# EAGLE design Sensor_ESP32_1.1 (EAGLE 9.6.2)
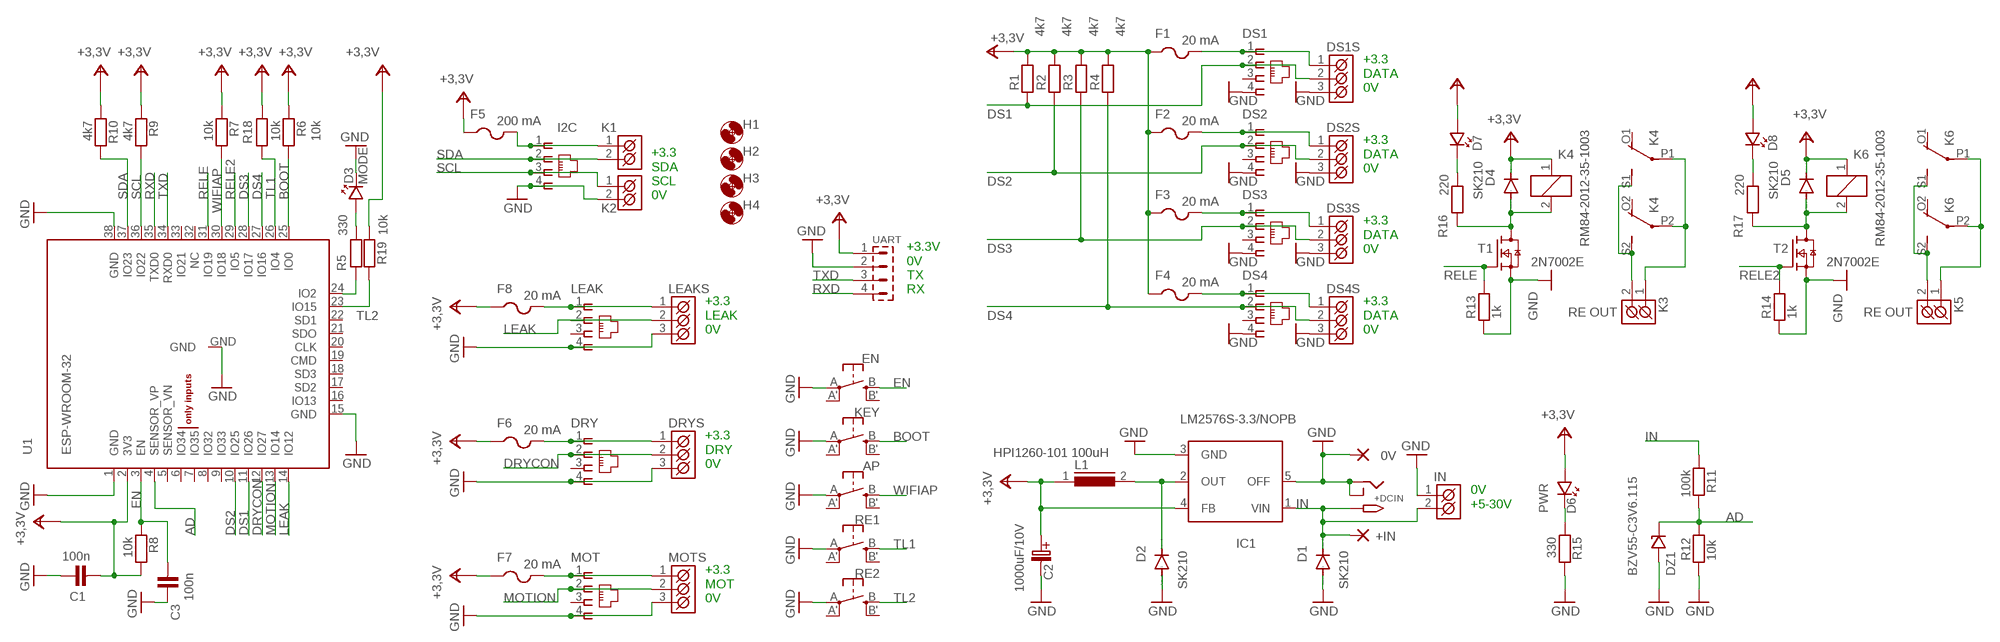
[diagram p0: schematic, sheet 1]

## Parts
0V  SMD2  [SMD1,27-2,54]
+DCIN  2.1MMJACKTHM  [PJ-102A]
+IN  SMD2  [SMD1,27-2,54]
AP  SPST_TACT-EVQQ2  [EVQ-Q2]
C1  100n  C-KER_1206  [1206]
C2  1000uF/10V  C-EL_5  [C-EL_5]
C3  100n  C-KER_1206  [1206]
D1  SK210  DIODE-SMB  [SMB]
D2  SK210  DIODE-SMB  [SMB]
D3  MODE  LED_1206  [P1206]
D4  SK210  DIODE-SMB  [SMB]
D5  SK210  DIODE-SMB  [SMB]
D6  PWR  LED_1206  [P1206]
D7  LED_1206  [P1206]
D8  LED_1206  [P1206]
DRY  WEBP_6_1  [WEBP_6_1]
DRYS  ARK550/3  [ARK550/3]
DS1  WEBP_6_1  [WEBP_6_1]
DS1S  ARK550/3  [ARK550/3]
DS2  WEBP_6_1  [WEBP_6_1]
DS2S  ARK550/3  [ARK550/3]
DS3  WEBP_6_1  [WEBP_6_1]
DS3S  ARK550/3  [ARK550/3]
DS4  WEBP_6_1  [WEBP_6_1]
DS4S  ARK550/3  [ARK550/3]
DZ1  BZV55-C3V6.115  D-BZV55C_SMD_0,5W-ZENER  [SOD-80]
EN  SPST_TACT-EVQQ2  [EVQ-Q2]
F1  20 mA  PTCFUSE-1206  [R1206]
F2  20 mA  PTCFUSE-1206  [R1206]
F3  20 mA  PTCFUSE-1206  [R1206]
F4  20 mA  PTCFUSE-1206  [R1206]
F5  200 mA  PTCFUSE-1206  [R1206]
F6  20 mA  PTCFUSE-1206  [R1206]
F7  20 mA  PTCFUSE-1206  [R1206]
F8  20 mA  PTCFUSE-1206  [R1206]
H1  MOUNT-HOLE3.0  [3,0]
H2  MOUNT-HOLE3.0  [3,0]
H3  MOUNT-HOLE3.0  [3,0]
H4  MOUNT-HOLE3.0  [3,0]
I2C  WEBP_6_1  [WEBP_6_1]
IC1  LM2576S-3.3/NOPB  LM2576S  [TO263-5]
IN  ARK550/2  [ARK550/2]
K1  ARK550/2  [ARK550/2]
K2  ARK550/2  [ARK550/2]
K3  RE OUT  ARK500/2  [ARK500/2]
K4  RM84-2012-35-1003  G2R2  [G2R2]
K5  RE OUT  ARK500/2  [ARK500/2]
K6  RM84-2012-35-1003  G2R2  [G2R2]
KEY  SPST_TACT-EVQQ2  [EVQ-Q2]
L1  HPI1260-101 100uH  DR125  [DR125]
LEAK  WEBP_6_1  [WEBP_6_1]
LEAKS  ARK550/3  [ARK550/3]
MOT  WEBP_6_1  [WEBP_6_1]
MOTS  ARK550/3  [ARK550/3]
R1  4k7  R_1206  [1206]
R2  4k7  R_1206  [1206]
R3  4k7  R_1206  [1206]
R4  4k7  R_1206  [1206]
R5  330  R_1206  [1206]
R6  10k  R_1206  [1206]
R7  10k  R_1206  [1206]
R8  10k  R_1206  [1206]
R9  4k7  R_1206  [1206]
R10  4k7  R_1206  [1206]
R11  100k  R_1206  [1206]
R12  10k  R_1206  [1206]
R13  1k  R_1206  [1206]
R14  1k  R_1206  [1206]
R15  330  R_1206  [1206]
R16  220  R_1206  [1206]
R17  220  R_1206  [1206]
R18  10k  R_1206  [1206]
R19  10k  R_1206  [1206]
RE1  SPST_TACT-EVQQ2  [EVQ-Q2]
RE2  SPST_TACT-EVQQ2  [EVQ-Q2]
T1  2N7002E  [SOT23]
T2  2N7002E  [SOT23]
U1  ESP-WROOM-32  [ESP-WROOM-32]
UART  S1G4_JUMP  [S1G4_JUM]

## Nets
+3,3V: C1.2 C2.C+(C_EL+) D4.C D5.C D6.A D7.A D8.A F1.1 F2.1 F3.1 F4.1 F5.1 F6.1 F7.1 F8.1 IC1.4(FB) K4.1 K6.1 L1.1 R1.2 R2.2 R3.2 R4.2 R6.1 R7.1 R8.2 R9.1 R10.1 R18.1 R19.1 U1.2(3V3) UART.1
AD: DZ1.K R11.2 R12.2 U1.4(SENSOR_VP)
BOOT: KEY.B(S) R6.2 U1.25(IO0)
DRYCON: DRY.2 DRYS.2(K2) U1.12(IO27)
DS1: DS1.2 DS1S.2(K2) R1.1 U1.11(IO26)
DS2: DS2.2 DS2S.2(K2) R2.1 U1.10(IO25)
DS3: DS3.2 DS3S.2(K2) R3.1 U1.28(IO17)
DS4: DS4.2 DS4S.2(K2) R4.1 U1.27(IO16)
EN: C3.2 EN.B(S) R8.1 U1.3(EN)
GND: 0V.1(P) +DCIN.RING +DCIN.RING_SW AP.A(P) C1.1 C2.C-(C_EL-) C3.1 D1.A D2.A D3.K DRY.4 DRYS.3(K3) DS1.4 DS1S.3(K3) DS2.4 DS2S.3(K3) DS3.4 DS3S.3(K3) DS4.4 DS4S.3(K3) DZ1.A EN.A(P) I2C.4 IC1.3(GND) IC1.5(OFF) IN.1(K1) K2.2(K2) KEY.A(P) LEAK.4 LEAKS.3(K3) MOT.4 MOTS.3(K3) R12.1 R13.1 R14.1 R15.2 RE1.A(P) RE2.A(P) T1.2(S) T2.2(S) U1.1(GND) U1.15(GND) U1.38(GND) U1.GND UART.2
IN: +DCIN.TIP +IN.1(P) D1.C IC1.1(VIN) IN.2(K2) R11.1
LEAK: LEAK.2 LEAKS.2(K2) U1.14(IO12)
MOTION: MOT.2 MOTS.2(K2) U1.13(IO14)
N$1: DS1.1 DS1S.1(K1) F1.2
N$2: D2.C IC1.2(OUT) L1.2
N$3: DS2.1 DS2S.1(K1) F2.2
N$4: F8.2 LEAK.1 LEAKS.1(K1)
N$5: DS3.1 DS3S.1(K1) F3.2
N$6: DS4.1 DS4S.1(K1) F4.2
N$7: F5.2 I2C.1 K1.1(K1)
N$8: D4.A K4.2 R16.2 T1.3(D)
N$9: R5.2 U1.24(IO2)
N$10: K3.2(K2) K4.S1(2:S) K4.S2(3:S)
N$11: K3.1(K1) K4.P1(2:P) K4.P2(3:P)
N$12: DRY.1 DRYS.1(K1) F6.2
N$13: F7.2 MOT.1 MOTS.1(K1)
N$14: D5.A K6.2 R17.2 T2.3(D)
N$15: K5.2(K2) K6.S1(2:S) K6.S2(3:S)
N$16: K5.1(K1) K6.P1(2:P) K6.P2(3:P)
N$17: D6.K R15.1
N$18: D3.A R5.1
N$19: D7.K R16.1
N$20: D8.K R17.1
RELE: R13.2 T1.1(G) U1.31(IO19)
RELE2: R14.2 T2.1(G) U1.29(IO5)
RXD: U1.35(TXD0) UART.4
SCL: I2C.3 K2.1(K1) R9.2 U1.36(IO22)
SDA: I2C.2 K1.2(K2) R10.2 U1.37(IO23)
TL1: R18.2 RE1.B(S) U1.26(IO4)
TL2: R19.2 RE2.B(S) U1.23(IO15)
TXD: U1.34(RXD0) UART.3
WIFIAP: AP.B(S) R7.2 U1.30(IO18)
Unconnected: AP.A'(P1) AP.B'(S1) DRY.3 DS1.3 DS2.3 DS3.3 DS4.3 EN.A'(P1) EN.B'(S1) K4.O1(2:O) K4.O2(3:O) K6.O1(2:O) K6.O2(3:O) KEY.A'(P1) KEY.B'(S1) LEAK.3 MOT.3 RE1.A'(P1) RE1.B'(S1) RE2.A'(P1) RE2.B'(S1) U1.5(SENSOR_VN) U1.6(IO34) U1.7(IO35) U1.8(IO32) U1.9(IO33) U1.16(IO13) U1.17(SD2) U1.18(SD3) U1.19(CMD) U1.20(CLK) U1.21(SDO) U1.22(SD1) U1.32(NC) U1.33(IO21)

## Notes on the sheet
- +3.3
  DATA
  0V
- +3.3
  DATA
  0V
- +3.3
  SDA
  SCL
  0V
- +3.3
  DATA
  0V
- +3.3V
  0V
  TX
  RX
- +3.3
  LEAK
  0V
- +3.3
  DATA
  0V
- +3.3
  DRY
  0V
- 0V
  +5-30V
- +3.3
  MOT
  0V

## Library data of the parts
0V +IN = wirepad:SMD2: SMD PAD
+DCIN = adafruit:2.1MMJACK: 2.1mm x 5.5mm THM DC jack with internal switch. Digikey part #PJ-102A, 4UCON part #05537 2.1mm x 5.5mm SMT DC jack with internal switch. Digikey part #PJ-002A-SMT, 4UCON part #03267 By microbuilder.eu & adafruit.com
AP EN KEY RE1 RE2 = adafruit:SPST_TACT: SMT 6mm switch, EVQQ2 series http://www.ladyada.net/library/eagle
C1 C3 = #PaJa_31:C-KER: Kondenzator - keramicky
C2 = #PaJa_31:C-EL: Kondenzator - elektrolyticky
D1 D2 D4 D5 = diode:DIODE-: DIODE
D3 D6-D8 = #PaJa_31:LED: LED - jednobarevna
DRY DS1-DS4 I2C LEAK MOT = #PaJa_konektory:WEBP_6_1
DRYS DS1S DS2S DS3S DS4S LEAKS MOTS = #PaJa_konektory:ARK550/3: Svorkovnice - roztec 3,5mm - trojita
DZ1 = #PaJa_31:D-?-ZENER: Zenerova dioda
F1-F8 = adafruit:PTCFUSE: PTC fuses, resettable thermistors
H1-H4 = holes:MOUNT-HOLE: MOUNTING HOLE with drill center marker
IC1 = v-reg-3:LM2576: National Semiconductor <http://www.national.com> 3.0A "Simple Switcher"(c) 52kHz, Vout 1.23-37V (HV: 57V), Vin 40V (HV: 60V), 50µA standby current
IN K1 K2 = #PaJa_konektory:ARK550/2: Svorkovnice - roztec 3,5mm - dvojita
K3 K5 = #PaJa_konektory:ARK500/2: Svorkovnice - roztec 5mm - dvojita
K4 K6 = relay:G2R2: RELAY 2 x switch, Omron; MF: OMRON COMPONENTS USA; MPN: G2R-2-DC6; OC_FARNELL: unknown; OC_NEWARK: 89C5317
L1 = inductors:DR125: High Power Density, High Efficiency, Shielded Inductors Source: coiltronics_dr_series.pdf; SPICEPREFIX: L
R1-R19 = #PaJa_31:R: Rezistor
T1 T2 = nxp_60:2N7002: N-channel TrenchMOS FET N-channel enhancement mode Field-Effect Transistor (FET) in a plastic package using TrenchMOS technology. AAL Eindhoven MK
U1 = esp32:ESP-WROOM-32
UART = #PaJa_konektory:S1G4_JUMP: Radove konektory - koliky - 4x

## Board
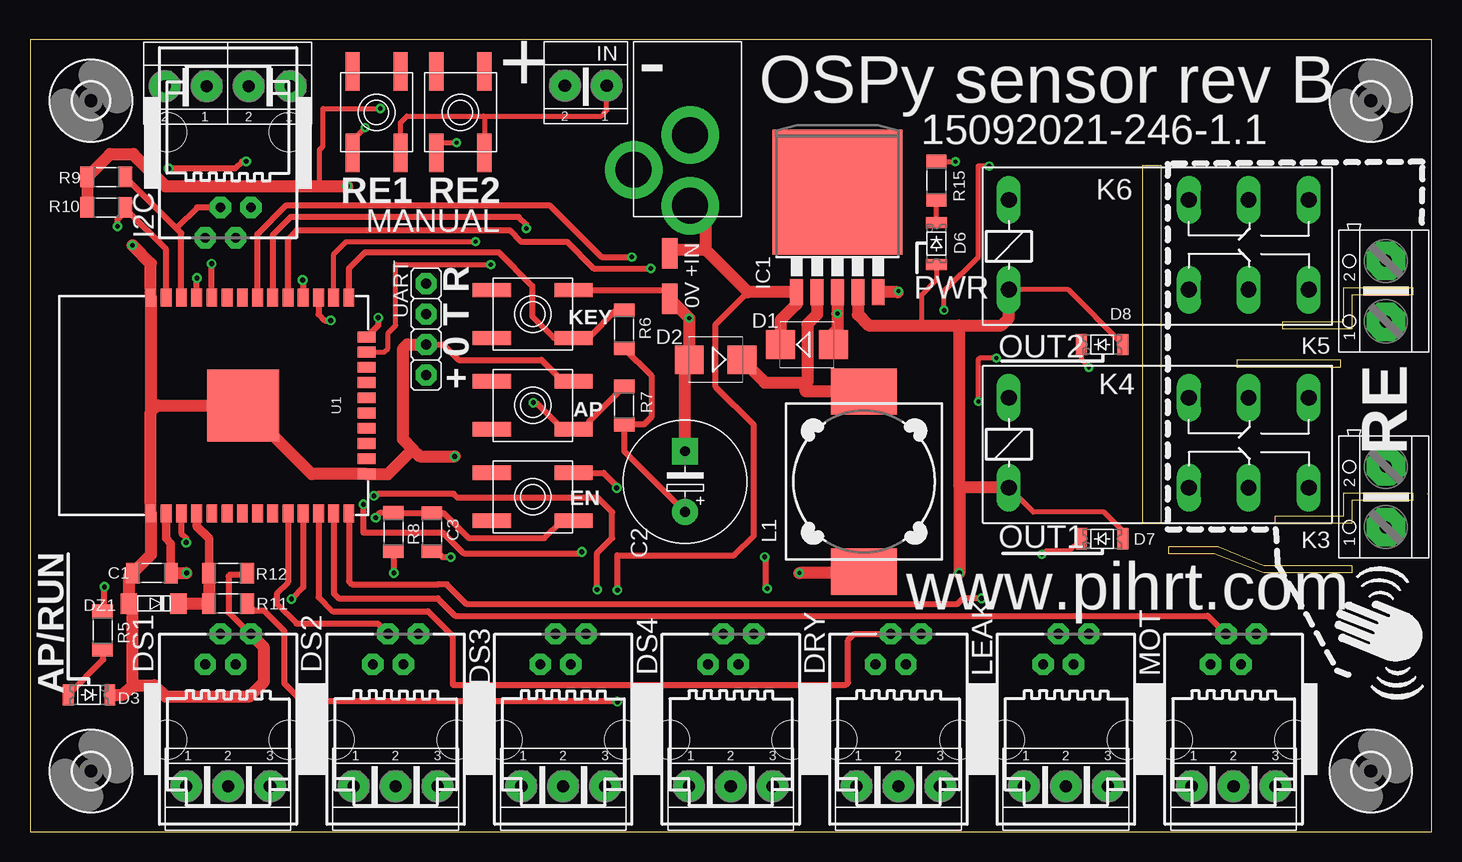
[diagram p1: board, top side]
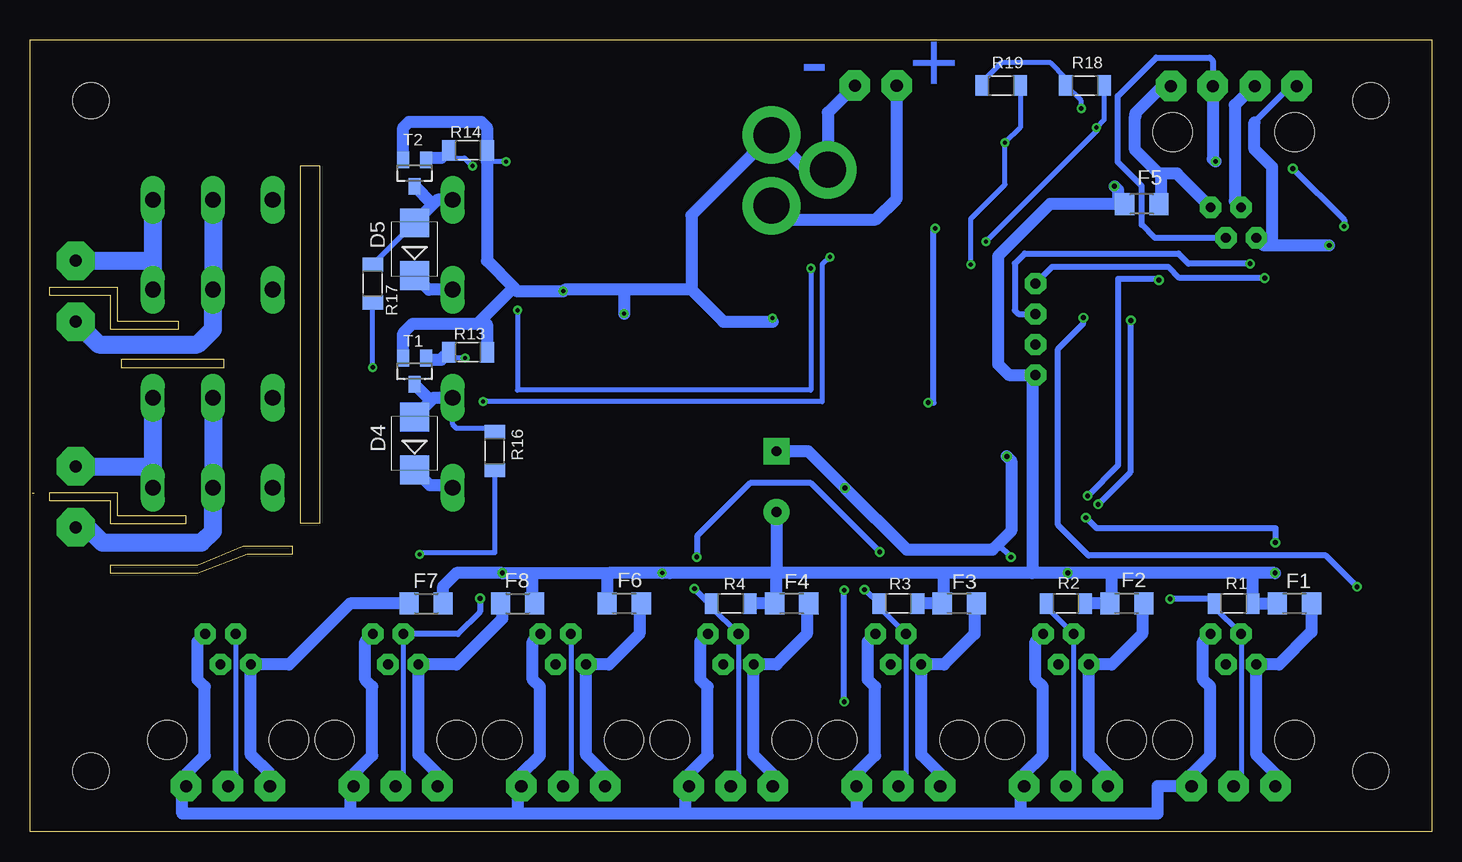
[diagram p2: board, bottom side, seen from below]

Size 116.84 x 66.04 mm. Coordinates in mm from the lower left corner, seen from the top.
Outline: 116.48,28.23 116.66,28.24
Outline: 0,0 116.84,0 116.84,66.04 0,66.04 0,0
Outline: 92.71,55.56 92.71,25.72 94.3,25.72 94.3,55.56 92.71,55.56
Outline: 104.46,42.55 109.54,42.55 109.54,45.4 115.25,45.4 115.25,44.77 110.17,44.77 110.17,41.91 104.46,41.91 104.46,42.55
Outline: 100.65,39.37 109.22,39.37 109.22,38.73 100.65,38.73 100.65,39.37
Outline: 103.82,26.35 109.54,26.35 109.54,28.26 115.25,28.26 115.25,27.62 110.17,27.62 110.17,25.72 103.82,25.72 103.82,26.35
Outline: 99.06,23.81 102.87,22.23 110.17,22.23 110.17,21.59 102.87,21.59 98.74,23.18 94.93,23.18 94.93,23.81 99.06,23.81
Copper layers (1*16): Top 0.035mm / dielectric 1.5mm / Bottom 0.035mm
Design rules "default": minimum track width 6mil, minimum drill 0.35mm, track to track 6mil, track to pad 6mil, pad to pad 6mil, via to via 6mil, smd to smd 6mil, copper to edge 40mil, drill to drill 6mil, minimum pad ring 10mil, minimum via ring 8mil, stop-mask expansion 4mil, vias tented up to drill 0mil, thermal gap 10mil

### Footprints (pad centres in the part's own frame; a part is rotated, then mirrored left to right if it is on the bottom)
SMD1,27-2,54 = smd 1.27 x 2.54: 1 0,0
PJ-102A = drill 3 pad 4.8: RING 0.1,-3.39; RING_SW -4.6,-6.29; TIP 0.1,-9.29
EVQ-Q2 = smd 3.2 x 1.2: A -3.4,-2; A' 3.4,-2; B -3.4,2; B' 3.4,2
1206 = smd 1.143 x 1.702: 1 -1.587,0; 2 1.587,0
C-EL_5 = drill 0.813 pad 2.184: C+ -2.54,0 | drill 0.813 pad 2.184 square: C- 2.54,0
SMB = smd 2.4 x 2.4: A 2.2,0; C -2.2,0
P1206 = smd 0.914 x 1.778: A -1.905,0; K 1.587,0
WEBP_6_1 = drill 0.813 pad 1.778 octagon: 1 -1.905,6.35; 2 -0.635,8.89; 3 0.635,6.35; 4 1.905,8.89 | hole 3.251: -5.08,0.064; 5.08,0.064
ARK550/3 = drill 1.016 pad 2.54 octagon: 1 -3.493,0; 2 0,0; 3 3.493,0
SOD-80 = smd 1.397 x 1.702: A 1.905,0; K -2.223,0
R1206 = smd 1.6 x 1.803: 1 -1.422,0; 2 1.422,0
3,0 = hole 3: 0,0
TO263-5 = smd 1.067 x 2.159: 1 -3.404,-5.791; 2 -1.702,-5.791; 3 0,-5.791; 4 1.702,-5.791; 5 3.404,-5.791 | smd 10.8 x 10.41: 6 0,2.54
ARK550/2 = drill 1.016 pad 2.54 octagon: 1 0,0; 2 3.493,0
ARK500/2 = drill 1 pad 3.2 octagon: 1 -2.54,0; 2 2.54,0
G2R2 = drill 1.321 long: 1 -2.54,-3.683; 2 -2.54,3.81; O1 12.471,3.81; O2 12.471,-3.683; P1 17.45,3.81; P2 17.45,-3.683; S1 22.454,3.81; S2 22.454,-3.683
DR125 = smd 3.85 x 5.5: 1 -7.515,0; 2 7.515,0
SOT23 = smd 1 x 1.4: 1 -0.95,-1.1; 2 0.95,-1.1; 3 0,1.1
ESP-WROOM-32 = smd 0.9 x 1.5: 1 7.7,9; 2 6.43,9; 3 5.16,9; 4 3.89,9; 5 2.62,9; 6 1.35,9; 7 0.08,9; 8 -1.19,9; 9 -2.46,9; 10 -3.73,9; 11 -5,9; 12 -6.27,9; 13 -7.54,9; 14 -8.81,9; 25 -8.81,-9; 26 -7.54,-9; 27 -6.27,-9; 28 -5,-9; 29 -3.73,-9; 30 -2.46,-9; 31 -1.19,-9; 32 0.08,-9; 33 1.35,-9; 34 2.62,-9; 35 3.89,-9; 36 5.16,-9; 37 6.43,-9; 38 7.7,-9 | smd 1.5 x 0.9: 15 -10.3,5.715; 16 -10.3,4.445; 17 -10.3,3.175; 18 -10.3,1.905; 19 -10.3,0.635; 20 -10.3,-0.635; 21 -10.3,-1.905; 22 -10.3,-3.175; 23 -10.3,-4.445; 24 -10.3,-5.715 | smd 6 x 6: GND 0,0
S1G4_JUM = drill 0.813 pad 1.778 octagon: 1 -3.81,0; 2 -1.27,0; 3 1.27,0; 4 3.81,0

### Placement (x,y rotation side)
0V  53.34,44.45 0 top
+DCIN  54.93,61.5 0 top
+IN  53.34,48.26 0 top
AP  41.91,35.56 180 top
C1  10.16,21.59 0 top
C2  54.61,29.21 90 top
C3  33.51,25 90 top
D1  64.77,40.64 0 top
D2  57.15,39.37 180 top
D3  5.08,11.43 0 top
D4  84.77,32.38 90 bottom
D5  84.77,48.58 90 bottom
D6  75.56,49.21 90 top
D7  89.22,24.45 180 top
D8  89.22,40.64 180 top
DRY  72.39,7.62 0 top
DRYS  72.39,3.81 0 top
DS1  16.51,7.62 0 top
DS1S  16.51,3.81 0 top
DS2  30.48,7.62 0 top
DS2S  30.48,3.81 0 top
DS3  44.45,7.62 0 top
DS3S  44.45,3.81 0 top
DS4  58.42,7.62 0 top
DS4S  58.42,3.81 0 top
DZ1  10.16,19.05 180 top
EN  41.91,27.94 180 top
F1  11.43,19.05 0 bottom
F2  25.4,19.05 0 bottom
F3  39.37,19.05 0 bottom
F4  53.34,19.05 0 bottom
F5  24.16,52.35 0 bottom
F6  67.31,19.05 0 bottom
F7  83.82,19.05 180 bottom
F8  76.2,19.05 180 bottom
H1  5.08,5.08 0 top
H2  5.08,60.96 0 top
H3  111.76,60.96 0 top
H4  111.76,5.08 0 top
I2C  16.51,58.42 180 top
IC1  67.31,50.8 0 top
IN  48.08,62.23 180 top
K1  21.73,62.19 180 top
K2  14.73,62.19 180 top
K3  113.03,27.94 90 top
K4  84.14,32.38 0 top
K5  113.03,45.09 90 top
K6  84.14,48.9 0 top
KEY  41.91,43.18 180 top
L1  69.53,29.21 90 top
LEAK  86.36,7.62 0 top
LEAKS  86.36,3.81 0 top
MOT  100.33,7.62 0 top
MOTS  100.33,3.81 0 top
R1  16.51,19.05 0 bottom
R2  30.48,19.05 0 bottom
R3  44.45,19.05 0 bottom
R4  58.42,19.05 0 bottom
R5  6.06,16.8 90 top
R6  49.53,41.91 90 top
R7  49.53,35.56 90 top
R8  30.3,25 270 top
R9  6.35,54.61 0 top
R10  6.35,52.07 0 top
R11  16.51,19.05 180 top
R12  16.51,21.59 180 top
R13  80.33,40.01 180 bottom
R14  80.33,56.83 180 bottom
R15  75.56,54.29 90 top
R16  78.11,31.75 90 bottom
R17  88.27,45.72 90 bottom
R18  28.89,62.23 0 bottom
R19  35.88,62.23 0 bottom
RE1  28.89,60.01 90 top
RE2  35.88,60.01 90 top
T1  84.77,38.42 180 bottom
T2  84.77,54.93 180 bottom
U1  17.78,35.56 180 top
U$1  [GESTURESENSE_NOTEXT]  116.2,10.79 90 top
UART  33.02,41.91 90 top

### Tracks (layer width: path | path; a pad name or v marks a point on that pad's centre or on a via)
+3,3V  (via drill 0.35, 0.4)
  Top 0.406: 77.66,28.7 77.47,28.89 | D6.A 75.56,46.04 74.3,44.77 74.3,42.23 | D7.A 91.12,25.08 89.53,26.67 83.63,26.67 K4.1 | D8.A 86.55,45.21 K6.1 | 24.13,53.84 24.13,56.87 24.43,57.18 24.43,60.31 24.45,60.33 v29.21,60.33 | L1.1 69.53,21.59
  Top 0.5: 26.44,53.84 v26.44,53.84 | R8.2 30.3,21.78 30.33,21.76 v30.33,21.59 | C2.C+ 49.53,31.75 R7.1 51.2,33.97 51.81,34.58 51.81,38.05 R6.1
  Top 0.7: U1.2 11.35,24.46 11.75,24.07 C1.2
  Top 1: R10.1 R9.1 6.68,56.52 8.61,56.52 11.3,53.84 24.13,53.84 26.44,53.84 | C1.2 13.01,21.59 13.03,21.57 v13.05,21.59 | IC1.4 69.01,43.12 69.91,42.23 74.3,42.23 77.47,42.23 | v77.47,21.59 77.47,28.89 77.47,42.23 | K4.1 77.66,28.7 | K6.1 81.6,42.86 80.96,42.23 77.47,42.23 | 69.53,21.59 v64.14,21.59
  Bottom 0.406: 84.77,30.16 D4.C | R19.1 37.47,62.55 35.88,64.14 31.75,64.14 30.48,62.87 R18.1 29.21,60.96 v29.21,60.33
  Bottom 1: F1.1 R1.2 14.92,21.59 | R2.2 F2.1 26.67,19.2 26.67,21.59 | R3.2 F3.1 40.64,19.2 40.64,21.59 | R4.2 F4.1 54.61,19.2 54.61,21.59 | 14.92,21.59 26.67,21.59 | 26.67,21.59 v30.33,21.59 33.28,21.59 | 33.28,21.59 40.64,21.59 | 40.64,21.59 54.61,21.59 | 54.61,21.59 63.5,21.59 v64.14,21.59 68.58,21.59 | 68.58,21.59 68.73,21.44 F6.1 | F7.1 82.4,20.47 81.28,21.59 v77.47,21.59 74.93,21.59 | 74.93,21.59 68.58,21.59 | F8.1 74.93,19.2 74.93,21.59 | v26.44,53.84 26.13,53.54 26.13,52.9 F5.1 31.81,52.35 36.15,48.01 36.15,39.01 35.24,38.1 UART.1 33.28,37.84 33.28,21.59 | v13.05,21.59 14.92,21.59 | C2.C+ 54.61,21.59 | K4.1 81.79,28.89 83.5,28.89 84.77,30.16 | K6.1 83.61,45.21 D5.C
AD
  Top 0.7: U1.4 13.91,26.54 13.91,25.48 14.92,24.47 R12.2
  Top 1: DZ1.K R11.2 R12.2
BOOT
  Top 0.5: R6.2 48.87,43.5 46.55,41.18 KEY.B 43.67,41.18 41.87,42.98 41.87,45.53 39.06,48.34 27.93,48.34 26.59,47 U1.25
DRYCON
  Top 0.5: U1.12 24.05,19.58 25.23,18.41 33.17,18.41 35.24,16.34 35.24,12.27 68.02,12.27 68.2,12.45 68.2,16.01 68.7,16.51 DRY.2
  Bottom 0.4: DRY.2 71.75,4.45 DRYS.2
DS1  (via drill 0.4)
  Top 0.5: U1.11 22.78,20.41 v21.79,19.42
  Bottom 0.4: DS1S.2 15.88,4.45 DS1.2 18.1,18.73 R1.1
  Bottom 0.5: v21.79,19.42 21.75,19.46 18.51,19.46 R1.1
DS2
  Top 0.5: U1.10 21.51,20.81 20.57,19.88 20.57,19.01 22.21,17.37 28.99,17.37 DS2.2
  Bottom 0.4: DS2S.2 29.84,4.45 DS2.2 32.07,18.73 R2.1
DS3  (via drill 0.4)
  Top 0.5: v47.28,20.2 47.28,23.27 48.52,24.5 48.52,26.68 47.35,27.85 35.67,27.85 35.33,28.19 29.04,28.19 28.78,27.92 v28.67,28.02 | v28.67,28.02 | v22.73,46.02 22.78,45.97 U1.28
  Bottom 0.4: DS3S.2 43.81,4.45 DS3.2 46.04,18.73 R3.1
  Bottom 0.5: R3.1 47.19,20.2 v47.28,20.2 | v28.67,28.02 26.13,30.56 26.13,46.12 22.8,46.12 22.8,46.09 v22.73,46.02
DS4  (via drill 0.4)
  Top 0.5: U1.27 24.05,43.16 24.57,42.65 v25.06,42.65 | v27.79,27.32 27.79,24.97 34.41,24.97 36.14,23.24 46.01,23.24 v46.01,23.35 | v61.26,22.92 61.31,22.86 61.31,20.39 61.43,20.28 v61.46,20.28
  Bottom 0.4: DS4S.2 57.78,4.45 DS4.2 60.01,18.73 R4.1
  Bottom 0.5: v25.06,42.65 25.11,42.65 25.11,29.99 v27.79,27.32 | v46.01,23.35 51.75,29.09 56.8,29.09 61.23,24.67 61.23,22.95 v61.26,22.92 | v61.46,20.28 60.23,19.05 R4.1
EN  (via drill 0.4)
  Top 0.5: v28.82,26.2 28.82,26.28 29.13,26.59 R8.1 C3.2 34.48,26.59 36.57,24.49 42.89,24.49 44.34,25.94 EN.B | v13.02,24.13 13.02,24.51 12.62,24.91 U1.3
  Bottom 0.5: v28.82,26.2 27.94,25.33 13.02,25.33 v13.02,24.13
GND  (via drill 0.35, 0.4)
  Top 0.406: v72.39,45.09 72.31,45.01 | 54.61,39.03 D2.A | R15.2 v77.15,55.88 | RE1.A 30.89,59.15 31.43,59.69 37.78,59.69 | 37.78,59.69 37.88,59.59 RE2.A | 37.78,59.69 47.62,59.69 48.08,60.15 IN.1 | 29.63,29.84 29.84,29.84
  Top 0.5: R12.1 17.95,21.44 16.67,21.44 16.55,21.32 16.55,18.29 18.34,16.51 DS1.4 | KEY.A 53.24,45.18 53.33,45.27 53.34,45.25 0V.1 | UART.2 34.46,40.64 35.74,39.36 42.63,39.36 44.43,37.56 AP.A | EN.A 47.81,29.94 48.9,28.85 v48.9,28.69 | C3.1 33.95,23.41 34.41,22.95 34.38,22.91 v35.07,22.91
  Top 1: D3.K 7.74,11.43 8.54,12.23 | 8.54,12.23 8.54,18.76 DZ1.A 8.26,21.27 C1.1 10.08,23.1 U1.1 10.08,35.03 | 10.08,35.03 10.61,35.56 U1.GND 23.5,29.84 U1.15 29.63,29.84 | 10.08,35.03 U1.38 10.08,47.41 8.59,48.9 v8.54,48.9 | 8.54,12.23 10.36,12.23 11.29,11.3 18.3,11.3 19.52,12.51 19.52,15.37 18.38,16.51 18.34,16.51 | IC1.3 v67.31,43.22 67.32,43.21 67.32,41.95 66.97,41.59 D1.A | 0V.1 v54.95,42.84 D2.A | UART.2 31.46,40.64 31.07,40.26 31.07,32.74 31.91,31.91 | 72.31,45.01 IC1.5 | C2.C- 54.61,39.03 | v35.4,31.31 32.51,31.31 31.91,31.91 | 29.84,29.84 31.91,31.91
  Bottom 0.406: 85.72,41.59 | 78.82,42.39 78.74,42.31 | 85.72,58.73 85.72,58.74 | 54.93,42.55 54.93,42.82 v54.95,42.84 | v77.15,55.88 78.74,55.88
  Bottom 0.5: K2.2 11.77,62.19 14.78,59.18 | v35.07,22.91 | 36.15,23.99 v35.07,22.91
  Bottom 1: DS1.4 19.05,15.88 19.05,12.7 18.45,12.1 18.45,6.38 20,4.83 DS1S.3 22.86,3.81 22.86,1.52 34.29,1.52 | DS2.4 33.02,15.88 33.02,12.7 32.42,12.1 32.42,6.38 33.97,4.83 DS2S.3 34.29,3.49 34.29,1.52 | DS3.4 46.99,15.88 46.99,12.7 46.39,12.1 46.39,6.38 47.94,4.83 DS3S.3 47.94,1.83 48.26,1.52 | DS4.4 60.96,15.88 60.96,12.7 60.36,12.1 60.36,6.38 61.91,4.83 DS4S.3 62.23,3.49 62.23,1.52 | DRY.4 74.93,15.88 74.93,12.7 74.33,12.1 74.33,6.38 75.88,4.83 DRYS.3 76.2,3.49 76.2,1.52 | LEAK.4 88.9,15.88 88.9,12.7 88.3,12.1 88.3,6.38 89.85,4.83 LEAKS.3 90.17,3.49 90.17,1.52 | MOT.4 102.87,15.88 102.87,12.7 102.27,12.1 102.27,6.38 103.82,4.83 MOTS.3 104.14,3.49 104.14,1.52 90.17,1.52 | 34.29,1.52 48.26,1.52 | 48.26,1.52 62.23,1.52 | 62.23,1.52 76.2,1.52 | 76.2,1.52 90.17,1.52 | 14.78,59.18 14.78,56.91 13.32,55.45 13.32,49.02 13.2,48.9 | v8.54,48.9 13.2,48.9 | 13.2,48.9 13.98,48.9 I2C.4 | IN.1 50.33,59.98 +DCIN.RING_SW 52.13,55.21 +DCIN.RING 61.71,51.42 61.71,45.21 | C2.C- 51.97,31.75 v48.9,28.69 43.75,23.54 36.6,23.54 36.15,23.99 35.03,25.11 35.03,30.94 v35.4,31.31 | 61.71,45.21 67.31,45.21 | 67.31,45.21 72.26,45.21 v72.39,45.09 76.2,45.09 76.52,45.4 | T1.2 85.72,41.59 | 85.72,41.59 84.93,42.39 79.53,42.39 | 79.53,42.39 78.82,42.39 | 78.74,42.31 R13.1 | T2.2 85.72,58.73 | 85.72,58.74 85.25,59.21 79.22,59.21 78.74,58.74 R14.1 78.74,55.88 78.74,47.62 76.52,45.4 | 79.53,42.39 76.52,45.4 | 67.31,45.21 v67.31,43.22 | 61.71,45.21 59.04,42.55 54.93,42.55
IN  (via drill 0.4)
  Top 0.5: R11.1 18.67,18.48 18.67,18.47 19.47,18.47 21.19,16.75 21.19,12.38 22.66,10.91 48.89,10.91 48.9,10.93 v48.97,10.86 | v48.97,20.16 48.97,23.06 58.7,23.06 60.34,24.69 60.34,33.92 57.16,37.1 57.16,42.32 59.84,45.01
  Top 1: D1.C 62.57,42.67 63.91,44 IC1.1 59.84,45.01 56.3,48.55 | 56.3,48.55 56.3,50.94 +DCIN.TIP | +IN.1 53.63,48.55 56.3,48.55
  Bottom 0.5: v48.97,10.86 v48.97,20.16 | v48.97,20.16 | v48.97,20.16
  Bottom 1: +DCIN.TIP 53.88,51.06 46.34,51.06 44.59,52.81 IN.2
LEAK  (via drill 0.4)
  Top 0.5: U1.14 26.59,20.89 26.83,20.66 34.05,20.66 34.05,20.65 34.73,20.65 36.4,18.98 77.26,18.98 77.75,19.47 v79.32,19.47
  Bottom 0.4: LEAK.2 85.72,4.45 LEAKS.2
  Bottom 0.5: v79.32,19.47 79.34,19.46 79.34,18.35 81.18,16.5 LEAK.2
MOTION
  Top 0.5: U1.13 25.32,19.88 25.71,19.49 33.99,19.49 35.45,18.02 98.18,18.02 MOT.2
  Bottom 0.4: MOT.2 99.69,4.45 MOTS.2
N$1
  Bottom 1: DS1S.1 13.02,4.83 14.61,6.42 DS1.1 12.7,13.97 10.01,16.66 F1.2
N$2
  Top 1: IC1.2 65.61,43.15 64.8,42.35 64.8,37.47 64.66,37.47 | D2.C 61.26,37.47 64.66,37.47 | L1.2 64.66,36.73 64.66,37.47
N$3
  Bottom 1: DS2S.1 26.99,4.83 28.57,6.42 DS2.1 26.67,13.97 24.13,16.51 24.13,18.9 F2.2
N$4
  Bottom 1: LEAKS.1 82.87,4.83 84.45,6.42 LEAK.1 81.28,13.97 77.47,17.78 77.47,18.9 F8.2
N$5
  Bottom 1: DS3S.1 40.96,4.83 42.55,6.42 DS3.1 40.64,13.97 38.1,16.51 38.1,18.9 F3.2
N$6
  Bottom 1: DS4S.1 54.93,4.83 56.52,6.42 DS4.1 54.61,13.97 52.07,16.51 52.07,18.9 F4.2
N$7
  Bottom 1: I2C.1 21.23,54.89 22.54,54.89 | 22.54,54.89 22.74,54.89 24.73,56.88 24.73,59.66 24.69,59.7 24.69,59.94 22.44,62.19 K1.1 | F5.2 22.54,52.55 22.54,54.89
N$8
  Bottom 0.406: D4.A 84.77,34.92 84.45,34.92 | 83.65,36.2 83.19,36.2 | R16.2 78.42,33.66 81.28,33.66 81.6,33.97 K4.2
  Bottom 1: K4.2 83.19,36.2 84.45,34.92 | T1.3 83.65,36.2
N$9  (via drill 0.4)
  Top 0.5: R5.2 6.06,18.54 6.03,18.57 6.15,18.69 6.15,20.38 v6.21,20.44 | v29.03,42.88 29.03,42.22 U1.24
  Bottom 0.5: v6.21,20.44 8.81,23.04 28.6,23.04 31.15,25.58 31.15,40.28 29.03,42.4 v29.03,42.88
N$10
  Bottom 1.5: K4.S1 106.59,30.48 | 106.59,30.48 K4.S2 | K3.2 106.59,30.48
N$11
  Bottom 0.406: K3.1 112.08,25.4
  Bottom 1.5: K4.P1 K4.P2 101.59,25.09 102.55,24.13 110.81,24.13 112.08,25.4
N$12
  Bottom 1: DRYS.1 68.9,4.83 70.48,6.42 DRY.1 68.58,13.97 66.04,16.51 66.04,18.9 F6.2
N$13
  Bottom 1: MOTS.1 96.84,4.83 98.42,6.42 MOT.1 95.25,13.97 90.17,19.05 F7.2
N$14
  Bottom 0.406: D5.A 84.77,50.8 R17.2 | 83.34,52.4 83.34,52.23
  Bottom 1: K6.2 82.87,52.7 83.34,52.23 84.77,50.8 | T2.3 83.34,52.4
N$15
  Bottom 0.406: 106.91,47.62 106.59,47.94
  Bottom 1.5: K6.S1 106.59,47.94 K6.S2 | K5.2 106.91,47.62
N$16
  Bottom 1.5: K6.P1 K6.P2 101.59,41.92 102.87,40.64 111.12,40.64 K5.1
N$17
  Top 0.406: D6.K R15.1
N$18
  Top 0.5: D3.A 6.12,14.37 R5.1
N$19  (via drill 0.35)
  Top 0.406: v84.36,23.13 84.65,23.42 86.6,23.42 D7.K
  Bottom 0.406: R16.1 78.11,23.3 84.19,23.3 v84.36,23.13
N$20  (via drill 0.35)
  Top 0.406: v88.27,38.73 87.63,39.37 D8.K
  Bottom 0.406: v88.27,38.73 R17.1
RELE  (via drill 0.35)
  Top 0.406: v79.06,35.88 79.06,39.37 79.2,39.51 v80.56,39.51
  Top 0.5: U1.31 18.97,49.85 21.37,52.25 43.32,52.25 47.62,47.94 v50.16,47.94
  Bottom 0.406: T1.1 83.82,39.69 83.5,39.37 | R13.2 82.18,39.74 82.18,39.51 v80.56,39.51 | v50.16,47.94 50.8,47.31 50.8,35.88 v79.06,35.88
  Bottom 1: 83.5,39.37 82.55,39.37 R13.2
RELE2  (via drill 0.35)
  Top 0.406: v76.2,43.5 76.2,45.09 79.06,47.94 79.06,55.53 v79.96,55.53
  Top 0.5: U1.29 21.51,49.45 22.23,50.16 40.01,50.16 40.96,49.21 44.77,49.21 46.99,46.99 v51.75,46.99
  Bottom 0.406: R14.2 82.55,56.2 | T2.1 83.82,56.2 80.62,56.2 v79.96,55.53 | v51.75,46.99 51.75,36.83 76.2,36.83 v76.2,43.5
  Bottom 1: 82.55,56.2 83.82,56.2
RXD  (via drill 0.4)
  Top 0.5: U1.35 13.89,45.92 13.91,45.94 v13.91,46.19
  Bottom 0.5: v13.91,46.19 21.01,46.19 21.95,47.12 31.62,47.12 UART.4
SCL
  Top 0.5: U1.36 12.62,49.93 12.2,50.35 | 12.2,50.35 R9.2 | I2C.3 13.92,52.07 12.2,50.35
  Bottom 1: I2C.3 16.41,52.61 16.41,60.6 14.83,62.19 K2.1
SDA  (via drill 0.4)
  Top 0.5: U1.37 11.35,48.58 8.07,51.86 | R10.2 7.94,51.99 8.07,51.86 | v18.02,55.9 17.67,55.9 17.07,55.31 11.61,55.31 11.56,55.36 v11.56,55.31 | v7.29,50.49 7.29,51.09 8.07,51.86
  Bottom 0.5: I2C.2 23.05,49.53 24.16,50.63 24.16,53.85 26.16,55.85 26.16,61.36 22.95,64.57 18.49,64.57 18.24,64.32 K1.2 | v11.56,55.31 7.29,51.04 v7.29,50.49
  Bottom 1: K1.2 18.24,56.13 v18.02,55.9 | v18.02,55.9
TL1  (via drill 0.35)
  Top 0.406: v27.94,58.74 26.89,57.69 RE1.B | U1.26 25.32,48.18 26.35,49.21 v37.15,49.21
  Bottom 0.406: R18.2 27.3,59.37 v27.94,58.74 27.94,58.42 v37.15,49.21
TL2  (via drill 0.35)
  Top 0.406: v35.56,57.47 33.97,57.47 33.88,57.37 RE2.B | U1.23 29.53,40.01 29.84,40.32 29.84,41.59 30.48,42.23 30.48,47.31 v38.42,47.31
  Bottom 0.406: R19.2 34.29,58.74 v35.56,57.47 35.56,53.98 38.42,51.12 v38.42,47.31
TXD  (via drill 0.4)
  Top 0.5: U1.34 15.16,47.18 15.24,47.26 15.14,47.36 v15.14,47.38
  Bottom 0.5: v15.14,47.38 20.26,47.38 21.11,48.23 33.91,48.23 34.74,47.4 34.74,43.47 34.45,43.18 UART.3
WIFIAP  (via drill 0.4)
  Top 0.5: R7.2 46.61,34.23 46.61,33.72 46.58,33.69 45.44,33.69 AP.B 44.42,33.56 42.23,35.75 41.96,35.75 v41.96,35.8 | v41.38,50.32 41.38,50.64 40.74,51.27 21.75,51.27 20.24,49.77 U1.30
  Bottom 0.5: v41.96,35.8 41.53,35.8 41.53,50.32 v41.38,50.32

### Text on the board
Bottom: + | -
tNames: + | - | OSPy sensor rev B | 15092021-246-1.1 | MANUAL | + 0 T R | PWR | OUT2 | RE | OUT1 | AP/RUN | www.pihrt.com